# EAGLE schematic schema (EAGLE 7.2.0)
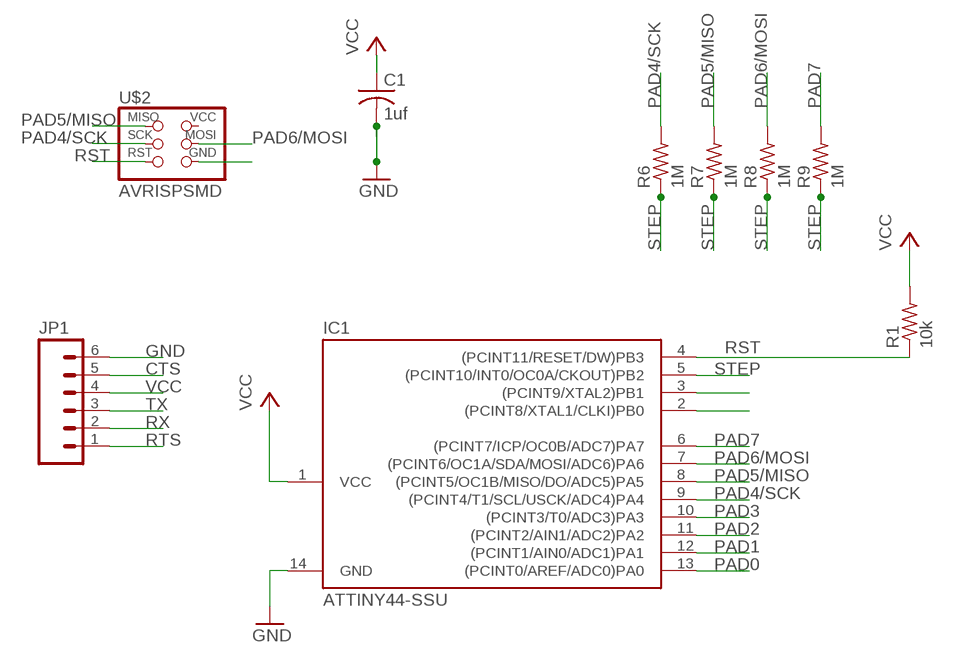
[diagram p0: schematic, sheet 1]

## Parts
C1  1uf  C-USC1206  [C1206]
IC1  ATTINY44-SSU  [SOIC14]
JP1  M06SMD  [1X06-SMD]
R1  10k  R-US_R1206  [R1206]
R6  1M  RESISTOR1206  [1206]
R7  1M  RESISTOR1206  [1206]
R8  1M  RESISTOR1206  [1206]
R9  1M  RESISTOR1206  [1206]
U$2  AVRISPSMD  [2X03SMD]

## Nets
CTS: JP1.5
GND: C1.2 IC1.14(GND) JP1.6 U$2.6(GND)
PAD0: IC1.13((PCINT0/AREF/ADC0)PA0)
PAD1: IC1.12((PCINT1/AIN0/ADC1)PA1)
PAD2: IC1.11((PCINT2/AIN1/ADC2)PA2)
PAD3: IC1.10((PCINT3/T0/ADC3)PA3)
PAD4/SCK: IC1.9((PCINT4/T1/SCL/USCK/ADC4)PA4) R6.2 U$2.3(SCK)
PAD5/MISO: IC1.8((PCINT5/OC1B/MISO/DO/ADC5)PA5) R7.2 U$2.1(MISO)
PAD6/MOSI: IC1.7((PCINT6/OC1A/SDA/MOSI/ADC6)PA6) R8.2 U$2.4(MOSI)
PAD7: IC1.6((PCINT7/ICP/OC0B/ADC7)PA7) R9.2
RST: IC1.4((PCINT11/RESET/DW)PB3) R1.1 U$2.5(RST)
RTS: JP1.1
RX: IC1.2((PCINT8/XTAL1/CLKI)PB0) JP1.2
STEP: IC1.5((PCINT10/INT0/OC0A/CKOUT)PB2) R6.1 R7.1 R8.1 R9.1
TX: IC1.3((PCINT9/XTAL2)PB1) JP1.3
VCC: C1.1 IC1.1(VCC) JP1.4 R1.2
Unconnected: U$2.2(VCC)

## Library data of the parts
C1 = rcl:C-US: CAPACITOR, American symbol
IC1 = fab:ATTINY44
JP1 = SparkFun:M06: Header 6 Standard 6-pin 0.1" header. Use with straight break away headers (SKU : PRT-00116), right angle break away headers (PRT-00553), swiss pins (PRT-00743), machine pins (PRT-00117), and female headers (PRT-00115). Molex polarized connector foot print use with SKU : PRT-08094 with associated crimp pins and housings. NOTES ON THE VARIANTS LOCK and LOCK_LONGPADS... This footprint was designed to help hold the alignment of a through-hole component (i.e. 6-pin header) while soldering it into place. You may notice that each hole has been shifted either up or down by 0.005 of an inch from it's more standard position (which is a perfectly straight line). This slight alteration caused the pins (the squares in the middle) to touch the edges of the holes. Because they are alternating, it causes a "brace" to hold the component in place. 0.005 has proven to be the perfect amount of "off-center" position when using our standard breakaway headers. Although looks a little odd when you look at the bare footprint, once you have a header in there, the alteration is very hard to notice. Also, if you push a header all the way into place, it is covered up entirely on the bottom side. This idea of altering the position of holes to aid alignment will be further integrated into the Sparkfun Library for other footprints. It can help hold any component with 3 or more connection pins.
R1 = resistor:R-US_: RESISTOR, American symbol
R6-R9 = 01_FAB_Hello:RESISTOR
U$2 = fab:AVRISP